# Altium schematic sheet IR_detector_project_updated.SchDoc
size A
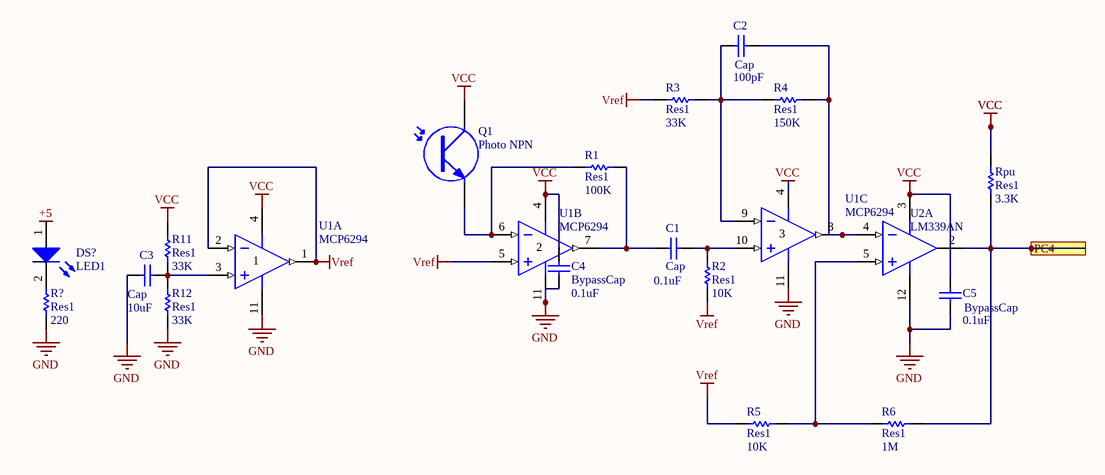
[diagram p0: IR_detector_project_updated.SchDoc]

## Parts
(Parts that share a designator on the sheet are numbered #1, #2 ... from top to bottom, then left to right.)
C1  Cap  value 0.1uF  [RAD-0.3]
C2  Cap  value 100pF  [RAD-0.3]
C3  Cap  value 10uF  [RAD-0.3]
C4  BypassCap  value 0.1uF  [RAD-0.3]
C5  BypassCap  value 0.1uF  [RAD-0.3]
DS?  LED1  [LED-1]
Q1  Photo NPN  [SFM-T2(3)/X1.6V]
R1  Res1  value 100K  [AXIAL-0.3]
R2  Res1  value 10K  [AXIAL-0.3]
R3  Res1  value 33K  [AXIAL-0.3]
R4  Res1  value 150K  [AXIAL-0.3]
R5  Res1  value 10K  [AXIAL-0.3]
R6  Res1  value 1M  [AXIAL-0.3]
R11  Res1  value 33K  [AXIAL-0.3]
R12  Res1  value 33K  [AXIAL-0.3]
R?  Res1  value 220  [AXIAL-0.3]
Rpu  Res1  value 3.3K  [AXIAL-0.3]
U1#1  MCP6294  [DIP-14/D19.7]  (parts B,C of 4)
U1#2  MCP6294  [DIP-14]  (part A of 4)
U2  LM339AN  [DIP-14/D19.7]  (part A of 4)

## Ports
PC4

## Nets
GND: C3.1 C4.2 C5.2 R12.1 R?.2 U1#1.11(V-) U1#2.11(GND) U2.12(GND)
VCC: C4.1 C5.1 Q1.1(C) R11.2 Rpu.2 U1#1.4(V+) U1#2.4(V+) U2.3(V+)
Vref: R2.1 R3.1 R5.1 U1#1.5(IN+) U1#2.1(OUT) U1#2.2(IN-)
PC4: R6.2 Rpu.1 U2.2(OUT) ; port PC4
NetC1_1: C1.1 R1.2 U1#1.7(OUT)
NetC1_2: C1.2 R2.2 U1#1.10(IN+)
NetC2_1: C2.1 R3.2 R4.1 U1#1.9(IN-)
NetC2_2: C2.2 R4.2 U1#1.8(OUT) U2.4(IN-)
NetC3_2: C3.2 R11.1 R12.2 U1#2.3(IN+)
NetQ1_3: Q1.3(E) R1.1 U1#1.6(IN-)
NetR5_2: R5.2 R6.1 U2.5(IN+)

Not connected (* = marked no-connect by the designer): DS? 1(A) 2(K); R? 1

## Notes on the sheet
- Labels drawn without touching a wire or pin: +5

## Library data of the parts
C1-C5 = Cap: Capacitor; Manufacturer: Generic Components; Class: Passive; Published: 08/06/2000; Publisher: Altium Hobart Technology Centre; SubClass: Capacitor
DS? = LED1: Typical RED GaAs LED; Manufacturer: Generic Components; Class: Optoelectronic; Published: 08/06/2000; Publisher: Altium Hobart Technology Centre; SubClass: LED
Q1 = Photo NPN: NPN Phototransistor; Manufacturer: Generic Components; Class: Optoelectronic; Published: 1999
R1-R6 R11 R12 R? Rpu = Res1: Resistor; Manufacturer: Generic Components; Class: Passive; Published: 08/06/2000; Publisher: Altium Hobart Technology Centre; SubClass: Resistor
U1#1 = MCP6294: Quad 1Ma 10MHz Rail-to-Rail I/O Operational Amplifier; Manufacturer: National Semiconductor; Published: 15/04/2002; Publisher: Altium Hobart Technology Centre; Class: Amplifier; SubClass: Operational Amplifier
U1#2 = LM324AJ: Low-Power Quad Operational Amplifier; Manufacturer: National Semiconductor; Published: 15/04/2002; Publisher: Altium Hobart Technology Centre; Class: Amplifier; SubClass: Operational Amplifier
U2 = LM339AN: Quad Single-Supply Comparator; Manufacturer: Motorola; Class: Analog; Published: 15/04/2002; Publisher: Altium Hobart Technology Centre; SubClass: Comparator